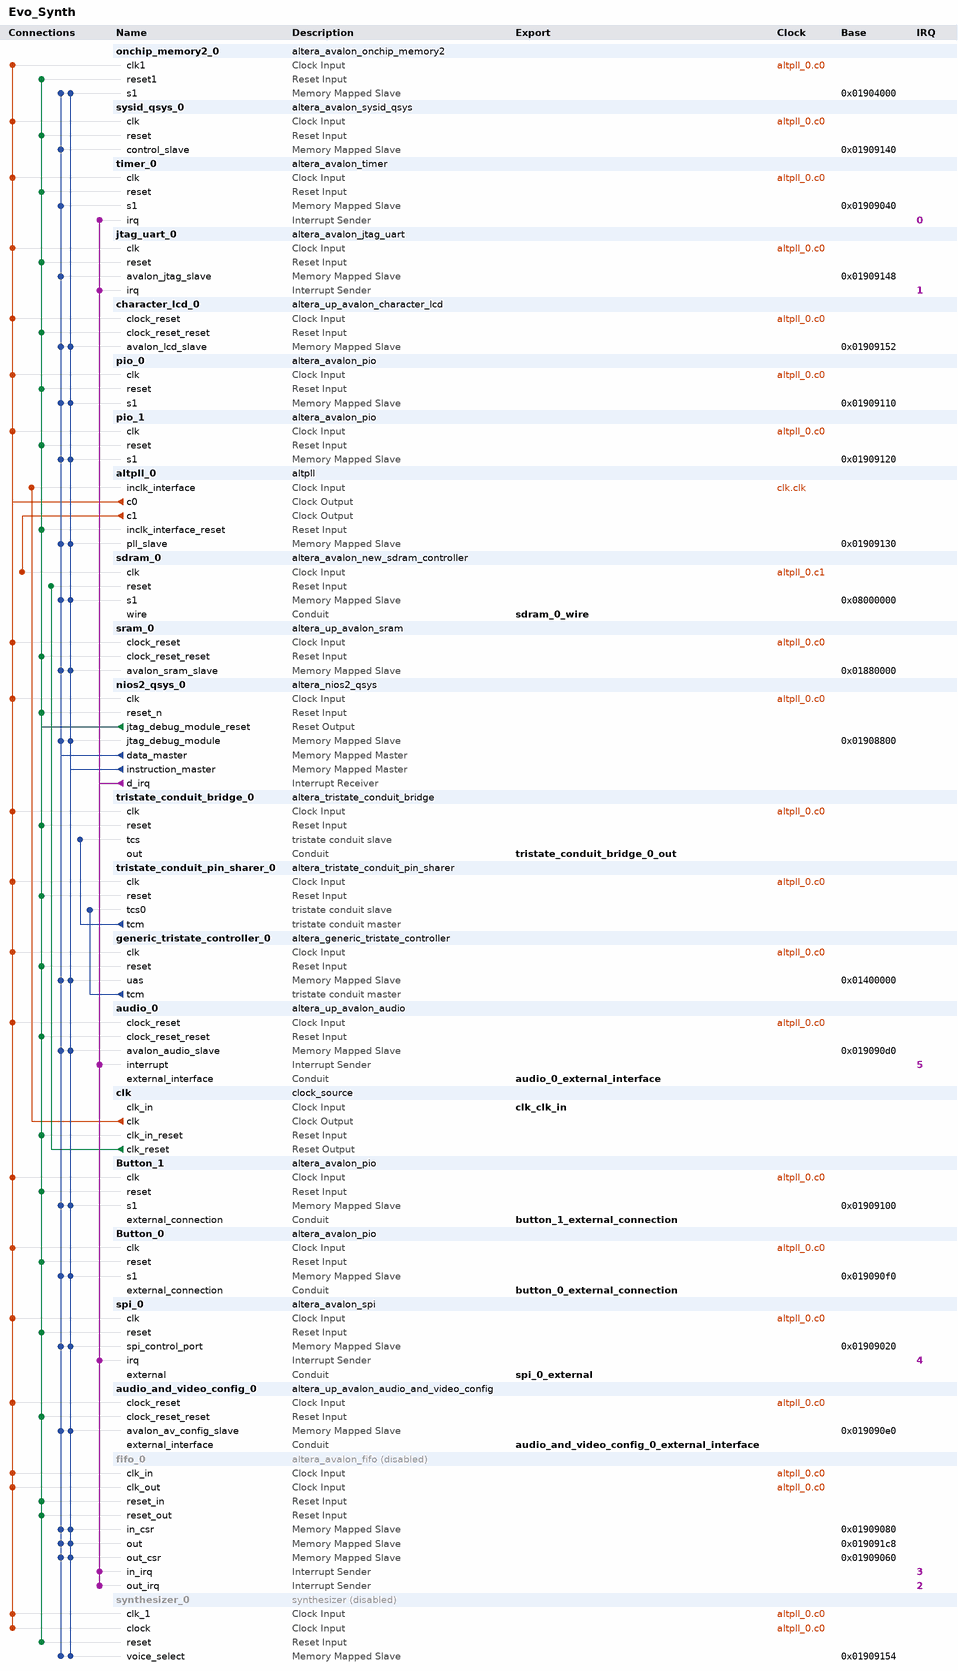
[diagram p0: system contents]
# Platform Designer (Qsys) system Evo_Synth, Cyclone II EP2C35F672C6
# Parameters at their usual value, and those the tool derives, are not listed.
package require -exact qsys 12.1
create_system Evo_Synth
set_project_property DEVICE_FAMILY {Cyclone II}
set_project_property DEVICE EP2C35F672C6

add_instance onchip_memory2_0 altera_avalon_onchip_memory2 12.1
set_instance_parameter_value onchip_memory2_0 dataWidth 32
set_instance_parameter_value onchip_memory2_0 dualPort false
set_instance_parameter_value onchip_memory2_0 initMemContent true
set_instance_parameter_value onchip_memory2_0 initializationFileName onchip_memory2_0
set_instance_parameter_value onchip_memory2_0 memorySize 16384

add_instance sysid_qsys_0 altera_avalon_sysid_qsys 12.1
set_instance_parameter_value sysid_qsys_0 id 0

add_instance timer_0 altera_avalon_timer 12.1
set_instance_parameter_value timer_0 period 1
set_instance_parameter_value timer_0 periodUnits MSEC
set_instance_parameter_value timer_0 timerPreset CUSTOM

add_instance jtag_uart_0 altera_avalon_jtag_uart 12.1
set_instance_parameter_value jtag_uart_0 simInteractiveOptions INTERACTIVE_INPUT_OUTPUT

add_instance character_lcd_0 altera_up_avalon_character_lcd 12.0
set_instance_parameter_value character_lcd_0 cursor Normal

add_instance pio_0 altera_avalon_pio 12.1
set_instance_parameter_value pio_0 direction Output
set_instance_parameter_value pio_0 width 8

add_instance pio_1 altera_avalon_pio 12.1
set_instance_parameter_value pio_1 direction Output
set_instance_parameter_value pio_1 width 8

add_instance altpll_0 altpll 12.1
set_instance_parameter_value altpll_0 INCLK0_INPUT_FREQUENCY 20000
set_instance_parameter_value altpll_0 GATE_LOCK_SIGNAL NO
set_instance_parameter_value altpll_0 VALID_LOCK_MULTIPLIER 1
set_instance_parameter_value altpll_0 INVALID_LOCK_MULTIPLIER 5
set_instance_parameter_value altpll_0 CLK0_MULTIPLY_BY 1
set_instance_parameter_value altpll_0 CLK1_MULTIPLY_BY 1
set_instance_parameter_value altpll_0 CLK0_DIVIDE_BY 1
set_instance_parameter_value altpll_0 CLK1_DIVIDE_BY 1
set_instance_parameter_value altpll_0 CLK1_PHASE_SHIFT 5000
set_instance_parameter_value altpll_0 CLK1_DUTY_CYCLE 50
set_instance_parameter_value altpll_0 PORT_clk1 PORT_USED
set_instance_parameter_value altpll_0 PORT_clk2 PORT_UNUSED
set_instance_parameter_value altpll_0 PORT_clk3 PORT_UNUSED
set_instance_parameter_value altpll_0 PORT_ARESET PORT_UNUSED
set_instance_parameter_value altpll_0 PORT_LOCKED PORT_UNUSED

add_instance sdram_0 altera_avalon_new_sdram_controller 12.1
set_instance_parameter_value sdram_0 TAC 5.5
set_instance_parameter_value sdram_0 TRCD 1.0
set_instance_parameter_value sdram_0 TRFC 4.0
set_instance_parameter_value sdram_0 TRP 1.0
set_instance_parameter_value sdram_0 TWR 0.6
set_instance_parameter_value sdram_0 casLatency 3
set_instance_parameter_value sdram_0 columnWidth 8
set_instance_parameter_value sdram_0 dataWidth 16
set_instance_parameter_value sdram_0 generateSimulationModel false
set_instance_parameter_value sdram_0 model custom
set_instance_parameter_value sdram_0 numberOfBanks 4
set_instance_parameter_value sdram_0 numberOfChipSelects 1
set_instance_parameter_value sdram_0 powerUpDelay 1.0
set_instance_parameter_value sdram_0 refreshPeriod 0.02
set_instance_parameter_value sdram_0 rowWidth 12

add_instance sram_0 altera_up_avalon_sram 12.0
set_instance_parameter_value sram_0 board DE2
set_instance_parameter_value sram_0 pixel_buffer false

add_instance nios2_qsys_0 altera_nios2_qsys 12.1
set_instance_parameter_value nios2_qsys_0 resetSlave generic_tristate_controller_0.uas
set_instance_parameter_value nios2_qsys_0 exceptionSlave onchip_memory2_0.s1
set_instance_parameter_value nios2_qsys_0 breakSlave nios2_qsys_0.jtag_debug_module
set_instance_parameter_value nios2_qsys_0 impl Tiny
set_instance_parameter_value nios2_qsys_0 icache_size 4096

add_instance tristate_conduit_bridge_0 altera_tristate_conduit_bridge 12.1

add_instance tristate_conduit_pin_sharer_0 altera_tristate_conduit_pin_sharer 12.1
set_instance_parameter_value tristate_conduit_pin_sharer_0 NUM_INTERFACES 1
set_instance_parameter_value tristate_conduit_pin_sharer_0 MODULE_ORIGIN_LIST generic_tristate_controller_0.tcm,generic_tristate_controller_0.tcm,generic_tristate_controller_0.tcm,generic_tristate_controller_0.tcm,generic_tristate_controller_0.tcm

add_instance generic_tristate_controller_0 altera_generic_tristate_controller 12.1
set_instance_parameter_value generic_tristate_controller_0 TCM_ADDRESS_W 22
set_instance_parameter_value generic_tristate_controller_0 TCM_DATA_W 8
set_instance_parameter_value generic_tristate_controller_0 TCM_BYTEENABLE_W 1
set_instance_parameter_value generic_tristate_controller_0 TCM_READ_WAIT 160
set_instance_parameter_value generic_tristate_controller_0 TCM_WRITE_WAIT 160
set_instance_parameter_value generic_tristate_controller_0 TCM_SETUP_WAIT 40
set_instance_parameter_value generic_tristate_controller_0 TCM_DATA_HOLD 40
set_instance_parameter_value generic_tristate_controller_0 TCM_MAX_PENDING_READ_TRANSACTIONS 3
set_instance_parameter_value generic_tristate_controller_0 TCM_TURNAROUND_TIME 2
set_instance_parameter_value generic_tristate_controller_0 TCM_TIMING_UNITS 0
set_instance_parameter_value generic_tristate_controller_0 TCM_READLATENCY 2
set_instance_parameter_value generic_tristate_controller_0 TCM_SYMBOLS_PER_WORD 1
set_instance_parameter_value generic_tristate_controller_0 USE_READ 1
set_instance_parameter_value generic_tristate_controller_0 USE_BEGINTRANSFER 0
set_instance_parameter_value generic_tristate_controller_0 USE_BYTEENABLE 0
set_instance_parameter_value generic_tristate_controller_0 USE_OUTPUTENABLE 0
set_instance_parameter_value generic_tristate_controller_0 ACTIVE_LOW_READ 1
set_instance_parameter_value generic_tristate_controller_0 ACTIVE_LOW_BYTEENABLE 0
set_instance_parameter_value generic_tristate_controller_0 ACTIVE_LOW_OUTPUTENABLE 0
set_instance_parameter_value generic_tristate_controller_0 ACTIVE_LOW_BEGINTRANSFER 0
set_instance_parameter_value generic_tristate_controller_0 CHIPSELECT_THROUGH_READLATENCY 0
set_instance_parameter_value generic_tristate_controller_0 MODULE_ASSIGNMENT_KEYS embeddedsw.configuration.hwClassnameDriverSupportList,embeddedsw.configuration.isFlash,embeddedsw.configuration.isMemoryDevice,embeddedsw.configuration.isNonVolatileStorage
set_instance_parameter_value generic_tristate_controller_0 MODULE_ASSIGNMENT_VALUES "altera_avalon_lan91c111\\,altera_avalon_cfi_flash,1,1,1"
set_instance_parameter_value generic_tristate_controller_0 INTERFACE_ASSIGNMENT_KEYS embeddedsw.configuration.isFlash,embeddedsw.configuration.isMemoryDevice,embeddedsw.configuration.isNonVolatileStorage
set_instance_parameter_value generic_tristate_controller_0 INTERFACE_ASSIGNMENT_VALUES 1,1,1

add_instance audio_0 altera_up_avalon_audio 12.0
set_instance_parameter_value audio_0 avalon_bus_type {Memory Mapped}
set_instance_parameter_value audio_0 audio_in true
set_instance_parameter_value audio_0 dw 32

add_instance clk clock_source 12.1
set_instance_parameter_value clk clockFrequency 50000000

add_instance Button_1 altera_avalon_pio 12.1
set_instance_parameter_value Button_1 direction Output
set_instance_parameter_value Button_1 width 1

add_instance Button_0 altera_avalon_pio 12.1
set_instance_parameter_value Button_0 direction Output
set_instance_parameter_value Button_0 width 1

add_instance spi_0 altera_avalon_spi 12.1
set_instance_parameter_value spi_0 clockPolarity 0
set_instance_parameter_value spi_0 dataWidth 32
set_instance_parameter_value spi_0 masterSPI true
set_instance_parameter_value spi_0 numberOfSlaves 1
set_instance_parameter_value spi_0 targetClockRate 128000

add_instance audio_and_video_config_0 altera_up_avalon_audio_and_video_config 12.0
set_instance_parameter_value audio_and_video_config_0 board DE2
set_instance_parameter_value audio_and_video_config_0 audio_in {Microphone to ADC}
set_instance_parameter_value audio_and_video_config_0 line_in_bypass false
set_instance_parameter_value audio_and_video_config_0 bit_length 32
set_instance_parameter_value audio_and_video_config_0 sampling_rate {32 kHz}

add_instance fifo_0 altera_avalon_fifo 12.1
set_instance_property fifo_0 ENABLED false
set_instance_parameter_value fifo_0 bitsPerSymbol 32
set_instance_parameter_value fifo_0 channelWidth 0
set_instance_parameter_value fifo_0 errorWidth 0
set_instance_parameter_value fifo_0 fifoDepth 32
set_instance_parameter_value fifo_0 fifoInputInterfaceOptions AVALONST_SINK
set_instance_parameter_value fifo_0 fifoOutputInterfaceOptions AVALONMM_READ
set_instance_parameter_value fifo_0 singleClockMode false
set_instance_parameter_value fifo_0 symbolsPerBeat 1
set_instance_parameter_value fifo_0 useBackpressure false
set_instance_parameter_value fifo_0 useIRQ true
set_instance_parameter_value fifo_0 usePacket false
set_instance_parameter_value fifo_0 useReadControl true

add_instance synthesizer_0 synthesizer 1.0
set_instance_property synthesizer_0 ENABLED false

# connections
add_connection altpll_0.c0 audio_0.clock_reset clock
add_connection altpll_0.c0 audio_and_video_config_0.clock_reset clock
add_connection altpll_0.c0 Button_0.clk clock
add_connection altpll_0.c0 Button_1.clk clock
add_connection altpll_0.c0 character_lcd_0.clock_reset clock
add_connection altpll_0.c0 fifo_0.clk_in clock
add_connection altpll_0.c0 fifo_0.clk_out clock
add_connection altpll_0.c0 generic_tristate_controller_0.clk clock
add_connection altpll_0.c0 jtag_uart_0.clk clock
add_connection altpll_0.c0 nios2_qsys_0.clk clock
add_connection altpll_0.c0 onchip_memory2_0.clk1 clock
add_connection altpll_0.c0 pio_0.clk clock
add_connection altpll_0.c0 pio_1.clk clock
add_connection altpll_0.c0 spi_0.clk clock
add_connection altpll_0.c0 sram_0.clock_reset clock
add_connection altpll_0.c0 synthesizer_0.clk_1 clock
add_connection altpll_0.c0 synthesizer_0.clock clock
add_connection altpll_0.c0 sysid_qsys_0.clk clock
add_connection altpll_0.c0 timer_0.clk clock
add_connection altpll_0.c0 tristate_conduit_bridge_0.clk clock
add_connection altpll_0.c0 tristate_conduit_pin_sharer_0.clk clock
add_connection altpll_0.c1 sdram_0.clk clock
add_connection clk.clk altpll_0.inclk_interface clock
add_connection clk.clk_reset sdram_0.reset reset
add_connection nios2_qsys_0.jtag_debug_module_reset altpll_0.inclk_interface_reset reset
add_connection nios2_qsys_0.jtag_debug_module_reset audio_0.clock_reset_reset reset
add_connection nios2_qsys_0.jtag_debug_module_reset audio_and_video_config_0.clock_reset_reset reset
add_connection nios2_qsys_0.jtag_debug_module_reset Button_0.reset reset
add_connection nios2_qsys_0.jtag_debug_module_reset Button_1.reset reset
add_connection nios2_qsys_0.jtag_debug_module_reset character_lcd_0.clock_reset_reset reset
add_connection nios2_qsys_0.jtag_debug_module_reset clk.clk_in_reset reset
add_connection nios2_qsys_0.jtag_debug_module_reset fifo_0.reset_in reset
add_connection nios2_qsys_0.jtag_debug_module_reset fifo_0.reset_out reset
add_connection nios2_qsys_0.jtag_debug_module_reset generic_tristate_controller_0.reset reset
add_connection nios2_qsys_0.jtag_debug_module_reset jtag_uart_0.reset reset
add_connection nios2_qsys_0.jtag_debug_module_reset nios2_qsys_0.reset_n reset
add_connection nios2_qsys_0.jtag_debug_module_reset onchip_memory2_0.reset1 reset
add_connection nios2_qsys_0.jtag_debug_module_reset pio_0.reset reset
add_connection nios2_qsys_0.jtag_debug_module_reset pio_1.reset reset
add_connection nios2_qsys_0.jtag_debug_module_reset spi_0.reset reset
add_connection nios2_qsys_0.jtag_debug_module_reset sram_0.clock_reset_reset reset
add_connection nios2_qsys_0.jtag_debug_module_reset synthesizer_0.reset reset
add_connection nios2_qsys_0.jtag_debug_module_reset sysid_qsys_0.reset reset
add_connection nios2_qsys_0.jtag_debug_module_reset timer_0.reset reset
add_connection nios2_qsys_0.jtag_debug_module_reset tristate_conduit_bridge_0.reset reset
add_connection nios2_qsys_0.jtag_debug_module_reset tristate_conduit_pin_sharer_0.reset reset
add_connection nios2_qsys_0.data_master altpll_0.pll_slave avalon
set_connection_parameter_value nios2_qsys_0.data_master/altpll_0.pll_slave baseAddress 0x01909130
add_connection nios2_qsys_0.data_master audio_0.avalon_audio_slave avalon
set_connection_parameter_value nios2_qsys_0.data_master/audio_0.avalon_audio_slave baseAddress 0x019090d0
add_connection nios2_qsys_0.data_master audio_and_video_config_0.avalon_av_config_slave avalon
set_connection_parameter_value nios2_qsys_0.data_master/audio_and_video_config_0.avalon_av_config_slave baseAddress 0x019090e0
add_connection nios2_qsys_0.data_master Button_0.s1 avalon
set_connection_parameter_value nios2_qsys_0.data_master/Button_0.s1 baseAddress 0x019090f0
add_connection nios2_qsys_0.data_master Button_1.s1 avalon
set_connection_parameter_value nios2_qsys_0.data_master/Button_1.s1 baseAddress 0x01909100
add_connection nios2_qsys_0.data_master character_lcd_0.avalon_lcd_slave avalon
set_connection_parameter_value nios2_qsys_0.data_master/character_lcd_0.avalon_lcd_slave baseAddress 0x01909152
add_connection nios2_qsys_0.data_master fifo_0.in_csr avalon
set_connection_parameter_value nios2_qsys_0.data_master/fifo_0.in_csr baseAddress 0x01909080
add_connection nios2_qsys_0.data_master fifo_0.out avalon
set_connection_parameter_value nios2_qsys_0.data_master/fifo_0.out baseAddress 0x019091c8
add_connection nios2_qsys_0.data_master fifo_0.out_csr avalon
set_connection_parameter_value nios2_qsys_0.data_master/fifo_0.out_csr baseAddress 0x01909060
add_connection nios2_qsys_0.data_master generic_tristate_controller_0.uas avalon
set_connection_parameter_value nios2_qsys_0.data_master/generic_tristate_controller_0.uas baseAddress 0x01400000
add_connection nios2_qsys_0.data_master jtag_uart_0.avalon_jtag_slave avalon
set_connection_parameter_value nios2_qsys_0.data_master/jtag_uart_0.avalon_jtag_slave baseAddress 0x01909148
add_connection nios2_qsys_0.data_master nios2_qsys_0.jtag_debug_module avalon
set_connection_parameter_value nios2_qsys_0.data_master/nios2_qsys_0.jtag_debug_module baseAddress 0x01908800
add_connection nios2_qsys_0.data_master onchip_memory2_0.s1 avalon
set_connection_parameter_value nios2_qsys_0.data_master/onchip_memory2_0.s1 baseAddress 0x01904000
add_connection nios2_qsys_0.data_master pio_0.s1 avalon
set_connection_parameter_value nios2_qsys_0.data_master/pio_0.s1 baseAddress 0x01909110
add_connection nios2_qsys_0.data_master pio_1.s1 avalon
set_connection_parameter_value nios2_qsys_0.data_master/pio_1.s1 baseAddress 0x01909120
add_connection nios2_qsys_0.data_master sdram_0.s1 avalon
set_connection_parameter_value nios2_qsys_0.data_master/sdram_0.s1 baseAddress 0x08000000
add_connection nios2_qsys_0.data_master spi_0.spi_control_port avalon
set_connection_parameter_value nios2_qsys_0.data_master/spi_0.spi_control_port baseAddress 0x01909020
add_connection nios2_qsys_0.data_master sram_0.avalon_sram_slave avalon
set_connection_parameter_value nios2_qsys_0.data_master/sram_0.avalon_sram_slave baseAddress 0x01880000
add_connection nios2_qsys_0.data_master synthesizer_0.voice_select avalon
set_connection_parameter_value nios2_qsys_0.data_master/synthesizer_0.voice_select baseAddress 0x01909154
add_connection nios2_qsys_0.data_master sysid_qsys_0.control_slave avalon
set_connection_parameter_value nios2_qsys_0.data_master/sysid_qsys_0.control_slave baseAddress 0x01909140
add_connection nios2_qsys_0.data_master timer_0.s1 avalon
set_connection_parameter_value nios2_qsys_0.data_master/timer_0.s1 baseAddress 0x01909040
add_connection nios2_qsys_0.instruction_master altpll_0.pll_slave avalon
set_connection_parameter_value nios2_qsys_0.instruction_master/altpll_0.pll_slave baseAddress 0x01909130
add_connection nios2_qsys_0.instruction_master audio_0.avalon_audio_slave avalon
set_connection_parameter_value nios2_qsys_0.instruction_master/audio_0.avalon_audio_slave baseAddress 0x019090d0
add_connection nios2_qsys_0.instruction_master audio_and_video_config_0.avalon_av_config_slave avalon
set_connection_parameter_value nios2_qsys_0.instruction_master/audio_and_video_config_0.avalon_av_config_slave baseAddress 0x019090e0
add_connection nios2_qsys_0.instruction_master Button_0.s1 avalon
set_connection_parameter_value nios2_qsys_0.instruction_master/Button_0.s1 baseAddress 0x019090f0
add_connection nios2_qsys_0.instruction_master Button_1.s1 avalon
set_connection_parameter_value nios2_qsys_0.instruction_master/Button_1.s1 baseAddress 0x01909100
add_connection nios2_qsys_0.instruction_master character_lcd_0.avalon_lcd_slave avalon
set_connection_parameter_value nios2_qsys_0.instruction_master/character_lcd_0.avalon_lcd_slave baseAddress 0x01909152
add_connection nios2_qsys_0.instruction_master fifo_0.in_csr avalon
set_connection_parameter_value nios2_qsys_0.instruction_master/fifo_0.in_csr baseAddress 0x01909080
add_connection nios2_qsys_0.instruction_master fifo_0.out avalon
set_connection_parameter_value nios2_qsys_0.instruction_master/fifo_0.out baseAddress 0x019091c8
add_connection nios2_qsys_0.instruction_master fifo_0.out_csr avalon
set_connection_parameter_value nios2_qsys_0.instruction_master/fifo_0.out_csr baseAddress 0x01909060
add_connection nios2_qsys_0.instruction_master generic_tristate_controller_0.uas avalon
set_connection_parameter_value nios2_qsys_0.instruction_master/generic_tristate_controller_0.uas baseAddress 0x01400000
add_connection nios2_qsys_0.instruction_master nios2_qsys_0.jtag_debug_module avalon
set_connection_parameter_value nios2_qsys_0.instruction_master/nios2_qsys_0.jtag_debug_module baseAddress 0x01908800
add_connection nios2_qsys_0.instruction_master onchip_memory2_0.s1 avalon
set_connection_parameter_value nios2_qsys_0.instruction_master/onchip_memory2_0.s1 baseAddress 0x01904000
add_connection nios2_qsys_0.instruction_master pio_0.s1 avalon
set_connection_parameter_value nios2_qsys_0.instruction_master/pio_0.s1 baseAddress 0x01909110
add_connection nios2_qsys_0.instruction_master pio_1.s1 avalon
set_connection_parameter_value nios2_qsys_0.instruction_master/pio_1.s1 baseAddress 0x01909120
add_connection nios2_qsys_0.instruction_master sdram_0.s1 avalon
set_connection_parameter_value nios2_qsys_0.instruction_master/sdram_0.s1 baseAddress 0x08000000
add_connection nios2_qsys_0.instruction_master spi_0.spi_control_port avalon
set_connection_parameter_value nios2_qsys_0.instruction_master/spi_0.spi_control_port baseAddress 0x01909020
add_connection nios2_qsys_0.instruction_master sram_0.avalon_sram_slave avalon
set_connection_parameter_value nios2_qsys_0.instruction_master/sram_0.avalon_sram_slave baseAddress 0x01880000
add_connection nios2_qsys_0.instruction_master synthesizer_0.voice_select avalon
set_connection_parameter_value nios2_qsys_0.instruction_master/synthesizer_0.voice_select baseAddress 0x01909154
add_connection nios2_qsys_0.d_irq audio_0.interrupt interrupt
set_connection_parameter_value nios2_qsys_0.d_irq/audio_0.interrupt irqNumber 5
add_connection nios2_qsys_0.d_irq fifo_0.in_irq interrupt
set_connection_parameter_value nios2_qsys_0.d_irq/fifo_0.in_irq irqNumber 3
add_connection nios2_qsys_0.d_irq fifo_0.out_irq interrupt
set_connection_parameter_value nios2_qsys_0.d_irq/fifo_0.out_irq irqNumber 2
add_connection nios2_qsys_0.d_irq jtag_uart_0.irq interrupt
set_connection_parameter_value nios2_qsys_0.d_irq/jtag_uart_0.irq irqNumber 1
add_connection nios2_qsys_0.d_irq spi_0.irq interrupt
set_connection_parameter_value nios2_qsys_0.d_irq/spi_0.irq irqNumber 4
add_connection nios2_qsys_0.d_irq timer_0.irq interrupt
set_connection_parameter_value nios2_qsys_0.d_irq/timer_0.irq irqNumber 0
add_connection generic_tristate_controller_0.tcm tristate_conduit_pin_sharer_0.tcs0 tristate_conduit
add_connection tristate_conduit_pin_sharer_0.tcm tristate_conduit_bridge_0.tcs tristate_conduit

# exported interfaces
add_interface tristate_conduit_bridge_0_out conduit end
set_interface_property tristate_conduit_bridge_0_out EXPORT_OF tristate_conduit_bridge_0.out
add_interface audio_0_external_interface conduit end
set_interface_property audio_0_external_interface EXPORT_OF audio_0.external_interface
add_interface spi_0_external conduit end
set_interface_property spi_0_external EXPORT_OF spi_0.external
add_interface button_1_external_connection conduit end
set_interface_property button_1_external_connection EXPORT_OF Button_1.external_connection
add_interface button_0_external_connection conduit end
set_interface_property button_0_external_connection EXPORT_OF Button_0.external_connection
add_interface clk_clk_in clock sink
set_interface_property clk_clk_in EXPORT_OF clk.clk_in
add_interface audio_and_video_config_0_external_interface conduit end
set_interface_property audio_and_video_config_0_external_interface EXPORT_OF audio_and_video_config_0.external_interface
add_interface sdram_0_wire conduit end
set_interface_property sdram_0_wire EXPORT_OF sdram_0.wire

save_system Evo_Synth.qsys
